# Altium schematic sheet AudioADCB.SchDoc
size A4
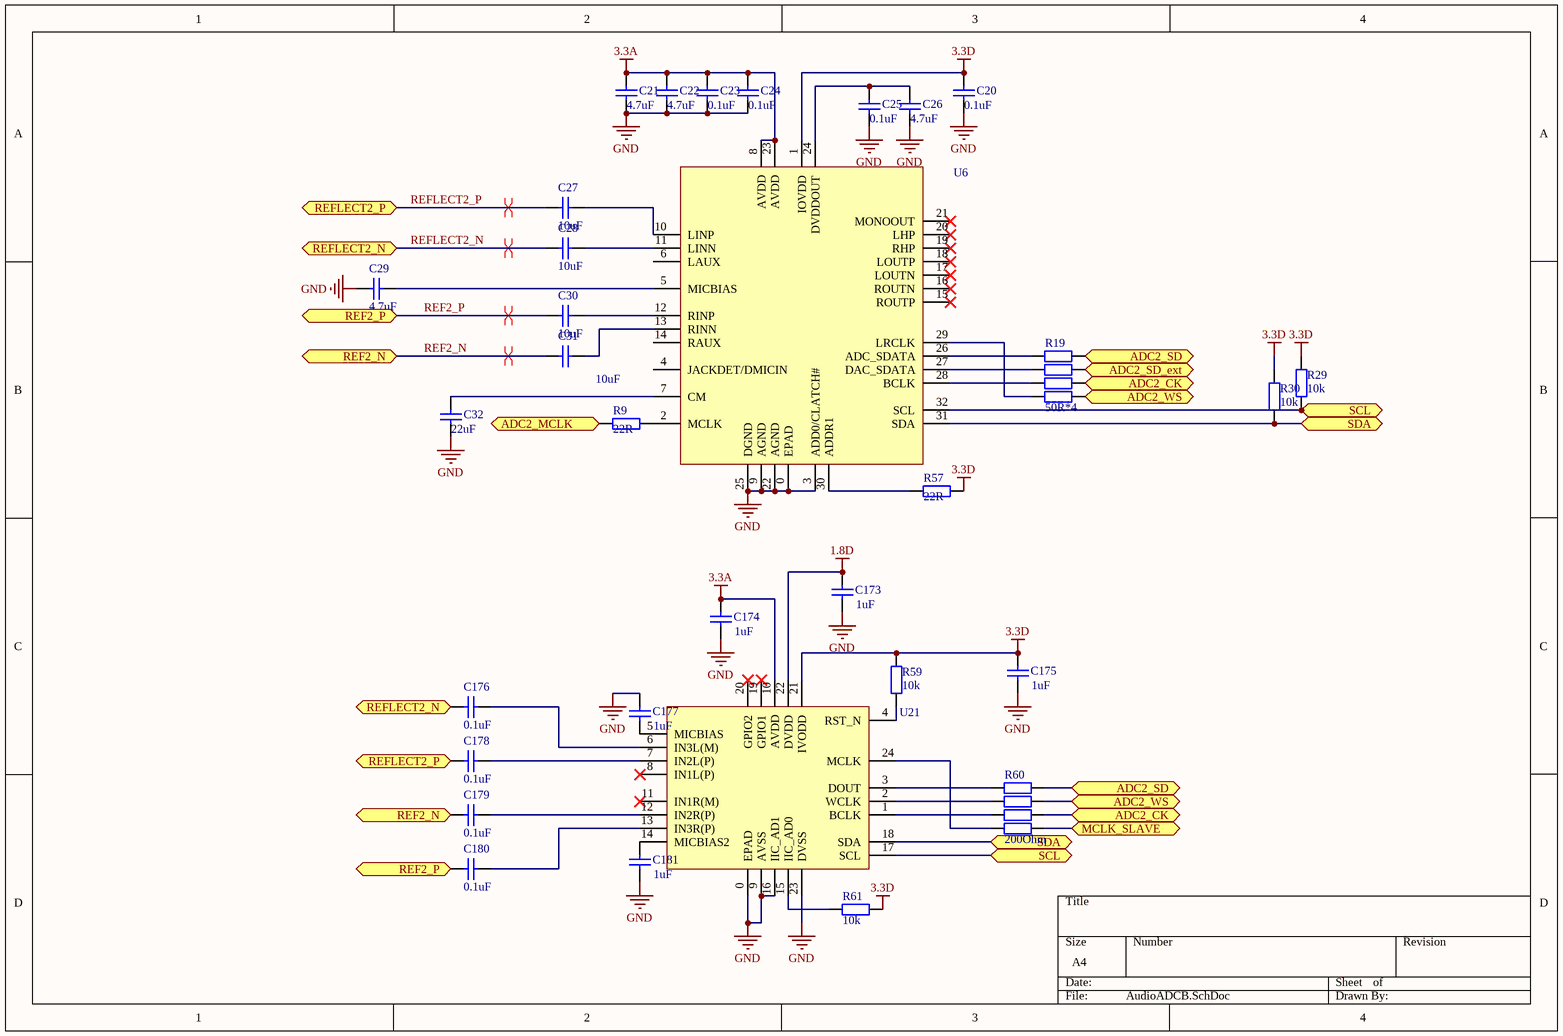
[diagram p0: AudioADCB.SchDoc]

## Parts
C20  0.1uF  [0402]
C21  4.7uF  [0805]
C22  4.7uF  [0805]
C23  0.1uF  [0402]
C24  0.1uF  [0402]
C25  0.1uF  [0402]
C26  4.7uF  [0805]
C27  10uF  [0402]
C28  10uF  [0402]
C29  4.7uF  [0402]
C30  10uF  [0402]
C31  10uF  [0402]
C32  22uF  [0805]
C173  1uF  [0402]
C174  1uF  [0402]
C175  1uF  [0402]
C176  0.1uF  [0402]
C177  1uF  [0402]
C178  0.1uF  [0402]
C179  0.1uF  [0402]
C180  0.1uF  [0402]
C181  1uF  [0402]
R9  22R  [0402]
R19  50R*4  [0402X4]
R29  value 10k  [0402]  (hidden comment: Res2)
R30  value 10k  [0402]  (hidden comment: Res2)
R57  22R  [0402]
R59  value 10k  [0402]  (hidden comment: Res2)
R60  value 200Ohm  [0402X4]  (hidden comment: Res*4)
R61  value 10k  [0402]  (hidden comment: Res2)
U6  ADAU1761  [ADAU1761]  (value not drawn)
U21  TLV320ADC3101  [TLV320ADC3101]  (value not drawn)

## Ports
ADC2_CK, ADC2_MCLK, ADC2_SD, ADC2_SD_ext, ADC2_WS, MCLK_SLAVE, REF2_N, REF2_P, REFLECT2_N, REFLECT2_P, SCL, SDA

## Nets
1.8D: C173.2 U21.22(DVDD)
3.3A: C21.2 C22.2 C23.2 C24.2 C174.2 U6.8(AVDD) U6.23(AVDD) U21.10(AVDD)
3.3D: C20.2 C175.2 R29.2 R30.2 R57.1 R59.2 R61.1 U6.1(IOVDD) U21.21(IVODD)
GND: C20.1 C21.1 C22.1 C23.1 C24.1 C25.1 C26.1 C29.1 C32.1 C173.1 C174.1 C175.1 C177.2 C181.1 U6.0(EPAD) U6.3(ADD0/CLATCH#) U6.9(AGND) U6.22(AGND) U6.25(DGND) U21.0(EPAD) U21.9(AVSS) U21.16(IIC_AD1) U21.23(DVSS)
ADC2_CK: R19.3 R60.6 ; port ADC2_CK
ADC2_MCLK: R9.2 ; port ADC2_MCLK
ADC2_SD: R19.1 R60.8 ; port ADC2_SD
ADC2_SD_ext: R19.2 ; port ADC2_SD_ext
ADC2_WS: R19.4 R60.7 ; port ADC2_WS
MCLK_SLAVE: R60.5 ; port MCLK_SLAVE
REF2_N: C31.1 C179.2 ; port REF2_N
REF2_P: C30.1 C180.2 ; port REF2_P
REFLECT2_N: C28.2 C176.2 ; port REFLECT2_N
REFLECT2_P: C27.2 C178.2 ; port REFLECT2_P
SCL: R29.1 U6.32(SCL) U21.17(SCL) ; port SCL
SDA: R30.1 U6.31(SDA) U21.18(SDA) ; port SDA
NetC25_2: C25.2 C26.2 U6.24(DVDDOUT)
NetC27_1: C27.1 U6.10(LINP)
NetC28_1: C28.1 U6.11(LINN)
NetC29_2: C29.2 U6.5(MICBIAS)
NetC30_2: C30.2 U6.12(RINP)
NetC31_2: C31.2 U6.13(RINN)
NetC32_2: C32.2 U6.7(CM)
NetC176_1: C176.1 U21.6(IN3L(M))
NetC177_1: C177.1 U21.5(MICBIAS)
NetC178_1: C178.1 U21.7(IN2L(P))
NetC179_1: C179.1 U21.12(IN2R(P))
NetC180_1: C180.1 U21.13(IN3R(P))
NetC181_2: C181.2 U21.14(MICBIAS2)
NetR9_1: R9.1 U6.2(MCLK)
NetR19_5: R19.5 U6.29(LRCLK)
NetR19_6: R19.6 U6.28(BCLK)
NetR19_7: R19.7 U6.27(DAC_SDATA)
NetR19_8: R19.8 U6.26(ADC_SDATA)
NetR57_2: R57.2 U6.30(ADDR1)
NetR59_1: R59.1 U21.4(RST_N)
NetR60_1: R60.1 U21.3(DOUT)
NetR60_2: R60.2 U21.2(WCLK)
NetR60_3: R60.3 U21.1(BCLK)
NetR60_4: R60.4 U21.24(MCLK)
NetR61_2: R61.2 U21.15(IIC_AD0)

Not connected (* = marked no-connect by the designer): U6 4(JACKDET/DMICIN) 6(LAUX) 14(RAUX) 15(ROUTP)* 16(ROUTN)* 17(LOUTN)* 18(LOUTP)* 19(RHP)* 20(LHP)* 21(MONOOUT)*; U21 8(IN1L(P))* 11(IN1R(M))* 19(GPIO1)* 20(GPIO2)*

## Layout directives
differential pair: REF2_N, REF2_P, REFLECT2_N, REFLECT2_P

## Library data of the parts
C20-C32 C173-C181 = Cap: Capacitor
  C20-C32 C176 C178-C180: Published: 8-Jun-2000; LatestRevisionDate: 17-Jul-2002; LatestRevisionNote: Re-released for DXP Platform.; PackageReference: RAD-0.3; Publisher: Altium Limited; PackageDescription: Radial Cap, Thru-Hole; 2 Leads; 0.3 in Pin Spacing
R9 R29 R30 R57 R59 R61 = Res2: Resistor; Published: 8-Jun-2000; LatestRevisionDate: 17-Jul-2002; LatestRevisionNote: Re-released for DXP Platform.; PackageReference: AXIAL-0.4; Publisher: Altium Limited; PackageDescription: Axial Device, Thru-Hole; 2 Leads; 0.4 in Pin Spacing
R19 R60 = Res*4: Resistor; Published: 8-Jun-2000; LatestRevisionDate: 17-Jul-2002; LatestRevisionNote: Re-released for DXP Platform.; PackageReference: AXIAL-0.4; Publisher: Altium Limited; PackageDescription: Axial Device, Thru-Hole; 2 Leads; 0.4 in Pin Spacing